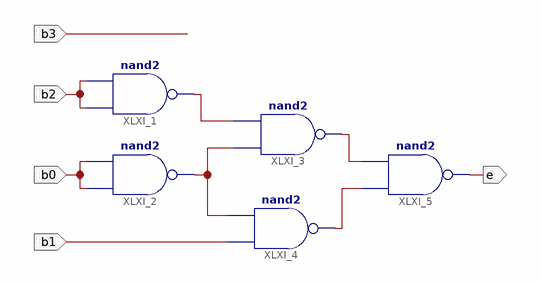
[diagram p0: schematic sheet 1]
// Xilinx ISE schematic e_block.sch (xc9500xl) as structural Verilog: 5 symbols, 5 ports
module e_block (
  input  b3,
  input  b1,
  input  b2,
  input  b0,
  output e
);

  wire XLXN_9, XLXN_11, XLXN_36, XLXN_37;

  nand XLXI_1 (XLXN_9, b2, b2);
  nand XLXI_2 (XLXN_11, b0, b0);
  nand XLXI_3 (XLXN_36, XLXN_11, XLXN_9);
  nand XLXI_4 (XLXN_37, b1, XLXN_11);
  nand XLXI_5 (e, XLXN_37, XLXN_36);
endmodule
